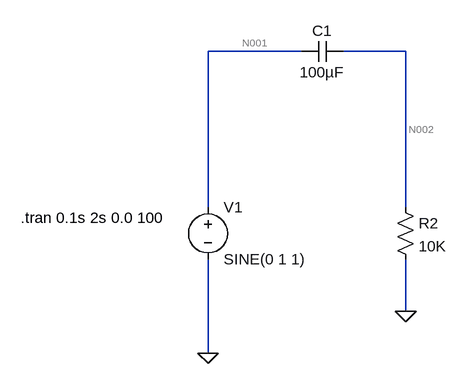
[diagram p0: schematic High_pass_filter.asc]
High_pass_filter.asc, the LTspice schematic file:
Version 4
SHEET 1 880 680
WIRE 112 -112 -32 -112
WIRE 272 -112 176 -112
WIRE -32 128 -32 -112
WIRE 272 128 272 -112
WIRE 272 288 272 208
WIRE -32 352 -32 208
FLAG -32 352 0
FLAG 272 288 0
SYMBOL voltage -32 112 R0
WINDOW 123 0 0 Left 2
WINDOW 39 0 0 Left 2
SYMATTR InstName V1
SYMATTR Value SINE(0 1 1)
SYMBOL cap 176 -128 R90
WINDOW 0 0 32 VBottom 2
WINDOW 3 32 32 VTop 2
SYMATTR InstName C1
SYMATTR Value 100µF
SYMBOL res 256 112 R0
SYMATTR InstName R2
SYMATTR Value 10K
TEXT -320 144 Left 2 !.tran 0.1s 2s 0.0 100

The netlist it stands for:
* High_pass_filter.asc
V1 N001 0 SINE(0 1 1)
C1 N002 N001 100µF
R2 N002 0 10K
.tran 0.1s 2s 0.0 100
.backanno
.end

* Results of the author's LTspice run, read from the files saved beside the schematic
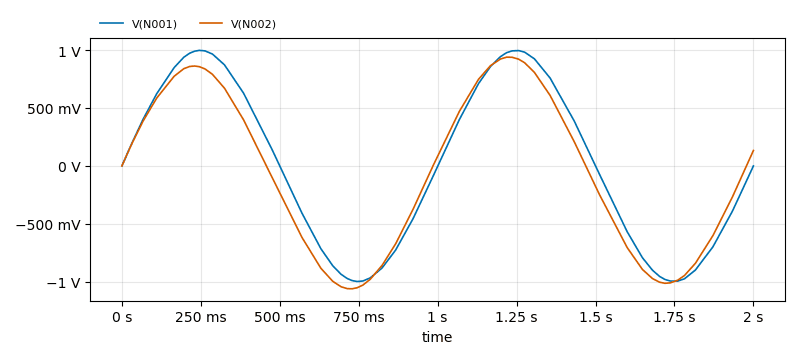
[diagram p1: Transient Analysis of High_pass_filter.asc, plotted from the saved traces]
* Transient Analysis, 1 run:
*   V(N001): min -996.6 mV, max 997 mV, average -1.24 mV, rms 702.6 mV, last 0 V
*   V(N002): min -1.06 V, max 938.3 mV, average -66.55 mV, rms 683.9 mV, last 133.3 mV